# EAGLE schematic PlugV3 (EAGLE 7.5.0)
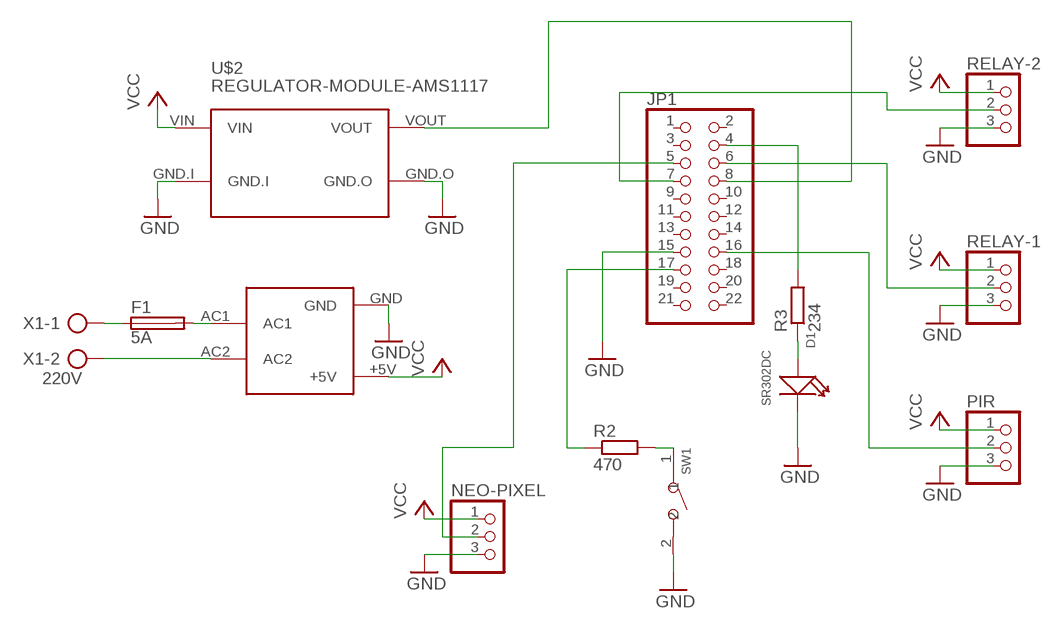
[diagram p0: schematic, sheet 1]

## Parts
D1  SR302DC  DIP-LED-RED-RED(2P-D3MM)  [LED2-2.54-D3.0MM]
F1  5A  SH22,5A  [SH22,5A]
JP1  PINHD-2X11  [2X11]
NEO-PIXEL  PINHD-1X3  [1X03]
PIR  PINHD-1X3  [1X03]
R2  470  R-EU_0207/7  [0207/7]
R3  234  R-EU_0207/7  [0207/7]
RELAY-1  PINHD-1X3  [1X03]
RELAY-2  PINHD-1X3  [1X03]
SW1  DIP-BUTTON(2P-6.0X3.0X4.3MM)-TS-1101F  [SW2-5.0-6.0X3.0X4.3MM]
U$1  HLK-PM01  [HLK-PM01]
U$2  REGULATOR-MODULE-AMS1117  [REGULATOR-MODULE-AMS1117]
X1  220V  AK300/2  [AK300/2]

## Nets
GND: D1.K(-) JP1.15 NEO-PIXEL.3 PIR.3 RELAY-1.3 RELAY-2.3 SW1.2 U$1.GND U$2.GND.I U$2.GND.O
N$1: F1.1 X1.1
N$2: F1.2 U$1.AC1
N$3: U$1.AC2 X1.2
N$4: JP1.8 U$2.VOUT
N$5: JP1.16 PIR.2
N$6: JP1.6 RELAY-1.2
N$7: JP1.7 RELAY-2.2
N$8: JP1.5 NEO-PIXEL.2
N$9: JP1.17 R2.1
N$10: R2.2 SW1.1
N$11: JP1.4 R3.2
N$12: D1.A(+) R3.1
VCC: NEO-PIXEL.1 PIR.1 RELAY-1.1 RELAY-2.1 U$1.+5V U$2.VIN
Unconnected: JP1.1 JP1.2 JP1.3 JP1.9 JP1.10 JP1.11 JP1.12 JP1.13 JP1.14 JP1.18 JP1.19 JP1.20 JP1.21 JP1.22

## Library data of the parts
D1 = Seeed-OPL-Diode:DIP-LED-RED-RED(2P-D3MM): 304090041; MPN: SR302DC
F1 = fuse:SH22,5A: FUSE HOLDER grid 22,5mm, isolated cap OGN0031 8201, Schurter (Buerklin); MPN: 0031.7701.11; OC_FARNELL: unknown; OC_NEWARK: 04F1224
JP1 = pinhead:PINHD-2X11: PIN HEADER
NEO-PIXEL PIR RELAY-1 RELAY-2 = pinhead:PINHD-1X3: PIN HEADER
R2 R3 = resistor:R-EU_: RESISTOR, European symbol
SW1 = Seeed-OPL-Switch:DIP-BUTTON(2P-6.0X3.0X4.3MM): 311020025
U$1 = HLK-PM01:HLK-PM01
U$2 = Regulator-Module-AMS1117-5to3V:REGULATOR-MODULE-AMS1117
X1 = con-ptr500:AK300/2: CONNECTOR; OC_FARNELL: unknown; OC_NEWARK: unknown